# EAGLE design master-v2 (EAGLE 7.1.0)
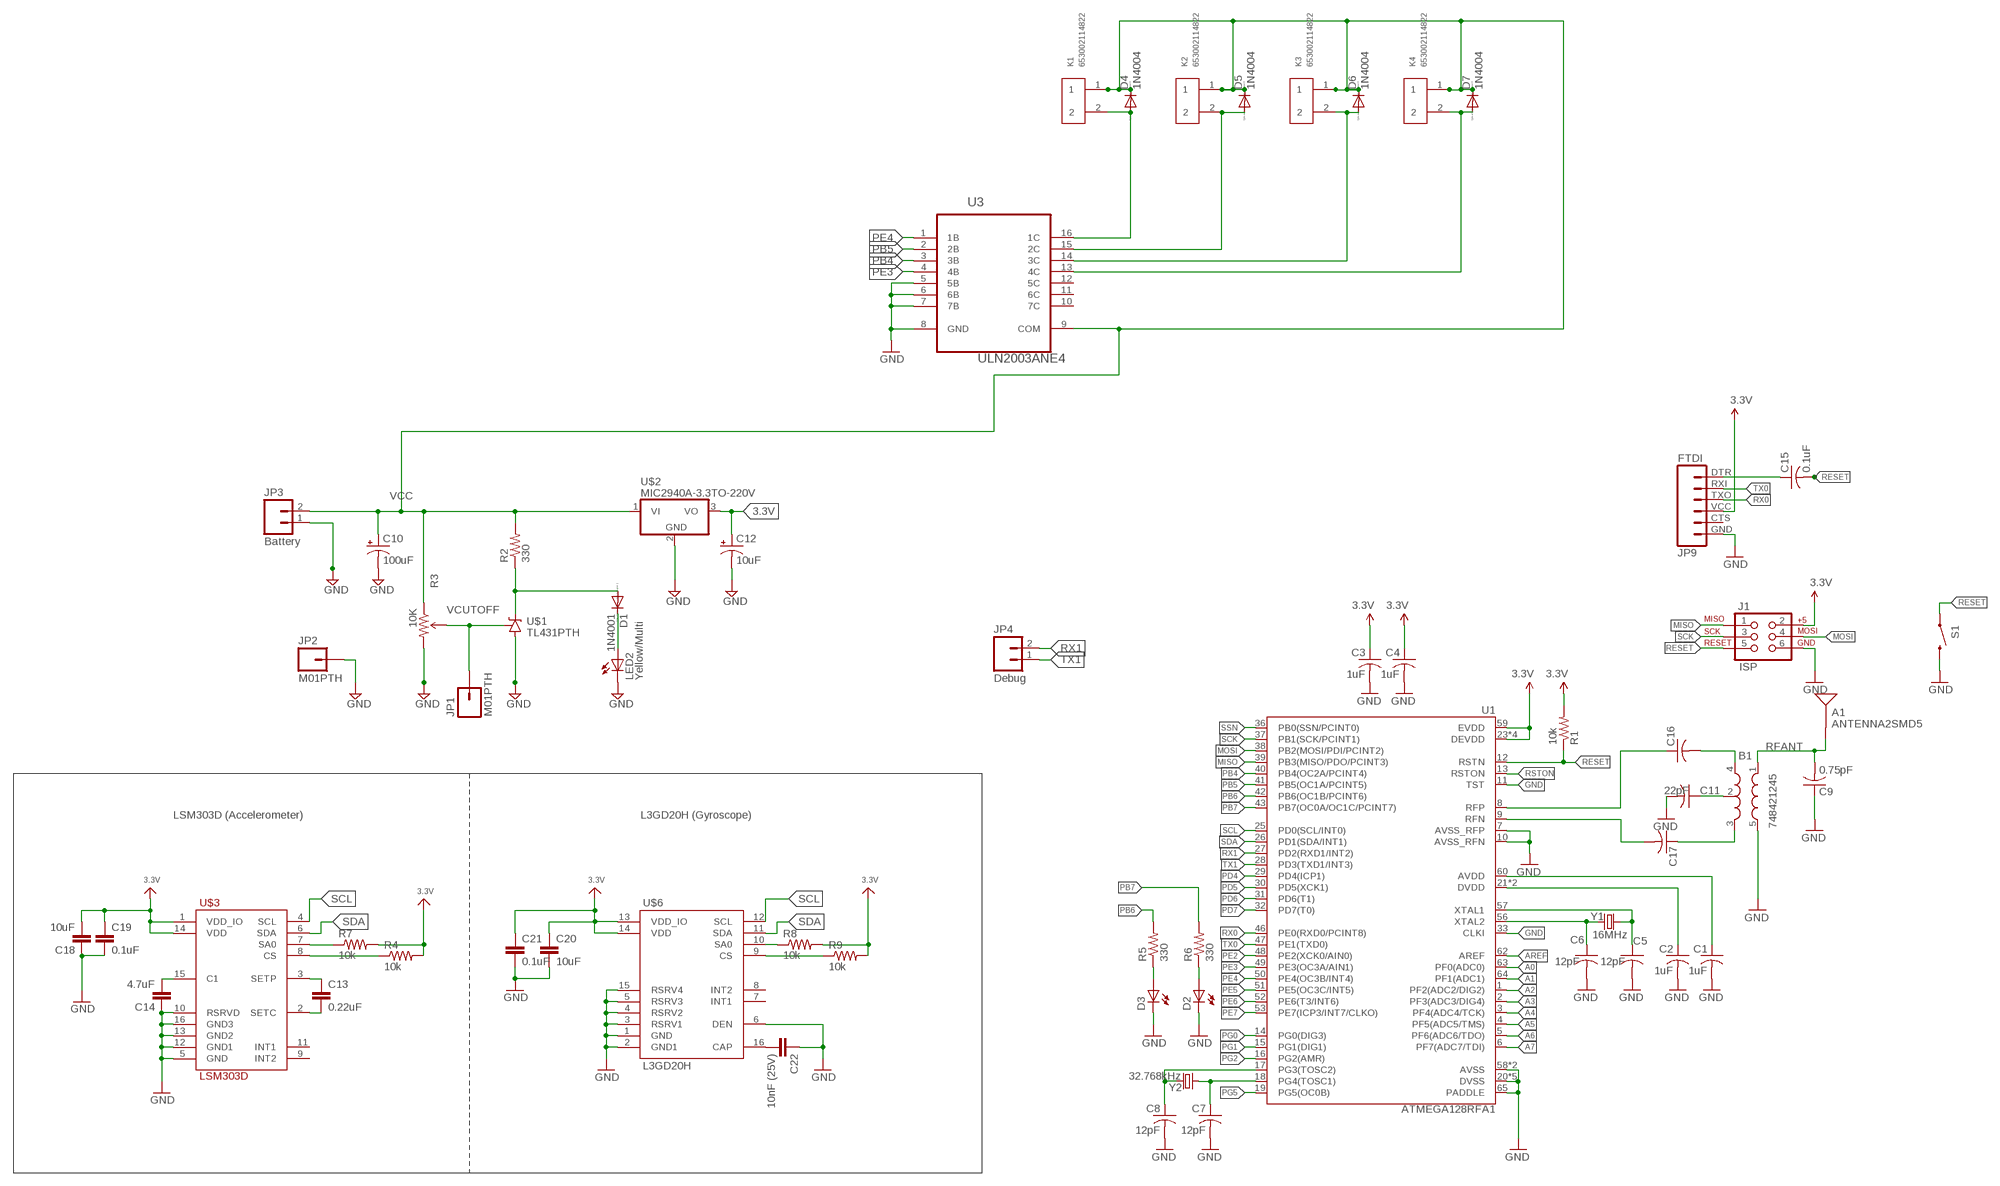
[diagram p0: schematic, sheet 1]

## Parts
A1  ANTENNA2SMD5  [ANTENNA-CHIP5]
B1  748421245  BALUN0805  [BALUN]
C1  1uF  C-USC0805  [C0805]
C2  1uF  C-USC0805  [C0805]
C3  1uF  C-USC0805  [C0805]
C4  1uF  C-USC0805  [C0805]
C5  12pF  C-USC0805  [C0805]
C6  12pF  C-USC0805  [C0805]
C7  12pF  C-USC0805  [C0805]
C8  12pF  C-USC0805  [C0805]
C9  0.75pF  C-USC0805  [C0805]
C10  100uF  CPOL-USE3.5-8  [E3,5-8]
C11  22pF  C-USC0805  [C0805]
C12  10uF  CPOL-USE2.5-5  [E2,5-5]
C13  0.22uF  CAP0805  [0805]
C14  4.7uF  CAP0805  [0805]
C15  0.1uF  C-USC0805  [C0805]
C16  C-USC0805  [C0805]
C17  C-USC0805  [C0805]
C18  10uF  CAP0805  [0805]
C19  0.1uF  CAP0805  [0805]
C20  10uF  CAP0805  [0805]
C21  0.1uF  CAP0805  [0805]
C22  10nF (25V)  CAP0805  [0805]
D1  1N4001  1N4004  [DO41-10]
D2  LED5MM  [LED5MM]
D3  LED5MM  [LED5MM]
D4  1N4004  [DO41-10]
D5  1N4004  [DO41-10]
D6  1N4004  [DO41-10]
D7  1N4004  [DO41-10]
J1  ISP  AVR_SPI_PRG_6NS  [2X3-NS]
JP1  M01PTH  [1X01]
JP2  M01PTH  [1X01]
JP3  Battery  M02PTH  [1X02]
JP4  Debug  M02PTH  [1X02]
JP9  FTDI  FTDI_BASICPTH  [FTDI_BASIC]
K1  653002114822  [653002114822]
K2  653002114822  [653002114822]
K3  653002114822  [653002114822]
K4  653002114822  [653002114822]
LED2  Yellow/Multi  LED5MM  [LED5MM]
R1  10k  R-US_R0805  [R0805]
R2  330  RESISTORAXIAL-0.3  [AXIAL-0.3]
R3  10K  TRIMPOT-PTH-KNOB  [3386U]
R4  10k  RESISTOR0805-RES  [0805]
R5  330  R-US_R0805  [R0805]
R6  330  R-US_R0805  [R0805]
R7  10k  RESISTOR0805-RES  [0805]
R8  10k  RESISTOR0805-RES  [0805]
R9  10k  RESISTOR0805-RES  [0805]
S1  SWITCH-MOMENTARY-2SMD  [TACTILE_SWITCH_SMD]
U1  ATMEGA128RFA1  [QFN-64]
U3  ULN2003ANE4  [DIP254P762X508-16]
U$1  TL431PTH  [TO-92]
U$2  MIC2940A-3.3TO-220V  [TO-220V]
U$3  LSM303D  [LGA16_3X3MM]
U$6  L3GD20H  [LGA16_3X3MM]
Y1  16MHz  CRYSTAL5X3  [CRYSTAL-SMD-5X3]
Y2  32.768kHz  CRYSTAL32-SMD  [CRYSTAL-32KHZ-SMD]

## Nets
3.3V: C3.1 C4.1 C12.+ C18.2 C19.1 C20.1 C21.1 J1.2 JP9.VCC R1.2 R4.2 R7.2 R8.2 R9.2 U1.23(DEVDD) U1.34(DEVDD) U1.44(DEVDD) U1.54(DEVDD) U1.59(EVDD) U$2.3(VO) U$3.1(VDD_IO) U$3.14(VDD) U$6.13(VDD_IO) U$6.14(VDD)
A0: U1.63(PF0(ADC0))
A1: U1.64(PF1(ADC1))
A2: U1.1(PF2(ADC2/DIG2))
A3: U1.2(PF3(ADC3/DIG4))
A4: U1.3(PF4(ADC4/TCK))
A5: U1.4(PF5(ADC5/TMS))
A6: U1.5(PF6(ADC6/TDO))
A7: U1.6(PF7(ADC7/TDI))
AREF: U1.62(AREF)
AVDD: C1.1 U1.60(AVDD)
DTR: C15.1 JP9.DTR
DVDD: C2.1 U1.21(DVDD) U1.22(DVDD)
GND: B1.5(GND) C1.2 C2.2 C3.2 C4.2 C5.2 C6.2 C7.2 C8.2 C9.1 C10.- C11.2 C12.- C14.1 C18.1 C19.2 C20.2 C21.2 C22.1 D2.K(C) D3.K(C) J1.6 JP2.1 JP3.1 JP9.GND LED2.K(C) R3.3(CW) S1.3 U1.7(AVSS_RFP) U1.10(AVSS_RFN) U1.11(TST) U1.20(DVSS) U1.24(DVSS) U1.33(CLKI) U1.35(DVSS) U1.45(DVSS) U1.55(DVSS) U1.58(AVSS) U1.61(AVSS) U1.65(PADDLE) U3.5(5B) U3.6(6B) U3.7(7B) U3.8(GND) U$1.2(A) U$2.2(GND) U$3.5(GND) U$3.10(RSRVD) U$3.12(GND1) U$3.13(GND2) U$3.16(GND3) U$6.1(GND) U$6.2(GND1) U$6.3(RSRV1) U$6.4(RSRV2) U$6.5(RSRV3) U$6.6(DEN) U$6.15(RSRV4)
MISO: J1.1 U1.39(PB3(MISO/PDO/PCINT3))
MOSI: J1.4 U1.38(PB2(MOSI/PDI/PCINT2))
N$1: D1.C LED2.A
N$2: D1.A R2.P$1 U$1.3(C)
N$3: C5.1 U1.57(XTAL1) Y1.3
N$4: C6.1 U1.56(XTAL2) Y1.1
N$5: C7.1 U1.18(PG4(TOSC1)) Y2.X1
N$6: C8.1 U1.17(PG3(TOSC2)) Y2.X2
N$7: B1.2(GND) C11.1
N$8: D3.A R5.1
N$9: C13.1 U$3.3(SETP)
N$10: B1.4(OUT1) C16.2
N$11: B1.3(OUT2) C17.1
N$12: C13.2 U$3.2(SETC)
N$13: D2.A R6.1
N$14: R4.1 U$3.8(CS)
N$15: R7.1 U$3.7(SA0)
N$16: C14.2 U$3.15(C1)
N$17: R8.1 U$6.10(SA0)
N$18: R9.1 U$6.9(CS)
N$19: C22.2 U$6.16(CAP)
N$29: D4.A K1.2 U3.16(1C)
N$30: D5.A K2.2 U3.15(2C)
N$31: D6.A K3.2 U3.14(3C)
N$32: D7.A K4.2 U3.13(4C)
PB4: U1.40(PB4(OC2A/PCINT4)) U3.3(3B)
PB5: U1.41(PB5(OC1A/PCINT5)) U3.2(2B)
PB6: R5.2 U1.42(PB6(OC1B/PCINT6))
PB7: R6.2 U1.43(PB7(OC0A/OC1C/PCINT7))
PD4: U1.29(PD4(ICP1))
PD5: U1.30(PD5(XCK1))
PD6: U1.31(PD6(T1))
PD7: U1.32(PD7(T0))
PE2: U1.48(PE2(XCK0/AIN0))
PE3: U1.49(PE3(OC3A/AIN1)) U3.4(4B)
PE4: U1.50(PE4(OC3B/INT4)) U3.1(1B)
PE5: U1.51(PE5(OC3C/INT5))
PE6: U1.52(PE6(T3/INT6))
PE7: U1.53(PE7(ICP3/INT7/CLKO))
PG0: U1.14(PG0(DIG3))
PG1: U1.15(PG1(DIG1))
PG2: U1.16(PG2(AMR))
PG5: U1.19(PG5(OC0B))
RESET: C15.2 J1.5 R1.1 S1.1 U1.12(RSTN)
RFANT [RFSIG]: A1.FEED(SIGNAL) B1.1(IN) C9.2
RFN: C17.2 U1.9(RFN)
RFP: C16.1 U1.8(RFP)
RSTON: U1.13(RSTON)
RX0: JP9.TXO U1.46(PE0(RXD0/PCINT8))
RX1: JP4.2 U1.27(PD2(RXD1/INT2))
SCK: J1.3 U1.37(PB1(SCK/PCINT1))
SCL: U1.25(PD0(SCL/INT0)) U$3.4(SCL) U$6.12(SCL)
SDA: U1.26(PD1(SDA/INT1)) U$3.6(SDA) U$6.11(SDA)
SSN: U1.36(PB0(SSN/PCINT0))
TX0: JP9.RXI U1.47(PE1(TXD0))
TX1: JP4.1 U1.28(PD3(TXD1/INT3))
VCC: C10.+ D4.C D5.C D6.C D7.C JP3.2 K1.1 K2.1 K3.1 K4.1 R2.P$2 R3.1(CCW) U3.9(COM) U$2.1(VI)
VCUTOFF: JP1.1 R3.2(WIPER) U$1.1(R)
Unconnected: JP9.CTS U3.10(7C) U3.11(6C) U3.12(5C) U$3.9(INT2) U$3.11(INT1) U$6.7(INT1) U$6.8(INT2)

## Notes on the sheet
- LSM303D (Accelerometer) | L3GD20H (Gyroscope)

## Library data of the parts
A1 = SparkFun-RF:ANTENNA2: Chip antenna Single endded antenna. Common with smaller chip antennas. CHIP4 package is the GPS Chip Antenna SKU: GPS-08418. CHIP5 package is 2.4GHz chip antenna SKU: WRL-00144.
B1 = SparkFun-RF:BALUN: 0805 footprint balun- Ember 351/357
C1-C9 C11 C15-C17 = resistor:C-US: CAPACITOR, American symbol
C10 C12 = rcl:CPOL-US: POLARIZED CAPACITOR, American symbol
C13 C14 C18-C22 = SparkFun-Capacitors:CAP: Capacitor Standard 0603 ceramic capacitor, and 0.1" leaded capacitor.
D1 = diode:1N4004: DIODE general purpose rectifier, 1 A
D2 D3 = Components:LED: LED OSRAM: - CHIPLED LG R971, LG N971, LY N971, LG Q971, LY Q971, LO R971, LY R971 LH N974, LH R974 LS Q976, LO Q976, LY Q976 LO Q996 - Hyper CHIPLED LW Q18S LB Q993, LB Q99A, LB R99A - SideLED LS A670, LO A670, LY A670, LG A670, LP A670 LB A673, LV A673, LT A673, LW A673 LH A674 LY A675 LS A676, LA A676, LO A676, LY A676, LW A676 LS A679, LY A679, LG A679 - Hyper Micro SIDELED® LS Y876, LA Y876, LO Y876, LY Y876 LT Y87S - SmartLED LW L88C, LW L88S LB L89C, LB L89S, LG L890 LS L89K, LO L89K, LY L89K LS L896, LA L896, LO L896, LY L896 - TOPLED LS T670, LO T670, LY T670, LG T670, LP T670 LSG T670, LSP T670, LSY T670, LOP T670, LYG T670 LG T671, LOG T671, LSG T671 LB T673, LV T673, LT T673, LW T673 LH T674 LS T676, LA T676, LO T676, LY T676, LB T676, LH T676, LSB T676, LW T676 LB T67C, LV T67C, LT T67C, LS T67K, LO T67K, LY T67K, LW E67C LS E67B, LA E67B, LO E67B, LY E67B, LB E67C, LV E67C, LT E67C LW T67C LS T679, LY T679, LG T679 LS T770, LO T770, LY T770, LG T770, LP T770 LB T773, LV T773, LT T773, LW T773 LH T774 LS E675, LA E675, LY E675, LS T675 LS T776, LA T776, LO T776, LY T776, LB T776 LHGB T686 LT T68C, LB T68C - Hyper Mini TOPLED® LB M676 - Mini TOPLED Santana® LG M470 LS M47K, LO M47K, LY M47K Source: http://www.osram.convergy.de/
D4-D7 = diode:1N4004: DIODE general purpose rectifier, 1 A; MF: NTE ELECTRONICS; MPN: 1N4004; OC_FARNELL: 2295710
J1 = SparkFun-Connectors:AVR_SPI_PRG_6: AVR ISP 6 Pin This is the reduced ISP connector for AVR programming. Common on Arduino. This footprint will take up less PCB space and can be used with a 10-pin to 6-pin adapter such as SKU: BOB-08508
JP1 JP2 = SparkFun:M01: Header 1 Standard 1-pin 0.1" header. Use with straight break away headers (SKU : PRT-00116), right angle break away headers (PRT-00553), swiss pins (PRT-00743), machine pins (PRT-00117), and female headers (PRT-00115).
JP3 JP4 = SparkFun:M02: Header 2 Standard 2-pin 0.1" header. Use with straight break away headers (SKU : PRT-00116), right angle break away headers (PRT-00553), swiss pins (PRT-00743), machine pins (PRT-00117), and female headers (PRT-00115). Molex polarized connector foot print use with SKU : PRT-08233 with associated crimp pins and housings.
JP9 = SparkFun-Connectors:FTDI_BASIC: FTDI Basic header with labels
K1-K4 = Wuerth_Elektronik_eiCan_Wire_to_Board_Connectors:653002114822: WR-WTB 1.25mm Male Vertical Shrouded Header, 2 Pins=>Code : Con_WTB_1.25_PCB_THT_653002114822 <http://katalog.we-online.de/media/thumbs2/eican/thb_Con_WTB_1.25_PCB_THT_6530xx114822_pf2.jpg> Details see: http://katalog.we-online.de/en/em/653_0xx_114_822 Created 2014-06-06, Karrer Zheng 2014 (C) Würth Elektronik; OC_FARNELL: unknown
LED2 = SparkFun:LED: LEDs Standard schematic elements and footprints for 5mm, 3mm, 1206, and 0603 sized LEDs. 5mm - Spark Fun Electronics SKU : COM-00529 (and others)
R1 R5 R6 = resistor:R-US_: RESISTOR, American symbol
R2 = SparkFun:RESISTOR: Resistor Basic schematic elements and footprints for 0603, 1206, and PTH resistors.
R3 = Power:TRIMPOT; CREATOR: Brandon; REVIEWER1: Chris
R4 R7-R9 = SparkFun-Passives:RESISTOR: Resistor Basic schematic elements and footprints for 0603, 1206, and PTH resistors.
S1 = SparkFun-Electromechanical:SWITCH-MOMENTARY-2: Various NO switches- pushbuttons, reed, etc
U1 = SparkFun-DigitalIC:ATMEGA128RFA1: ATmega128RFA1 8-bit AVR Microcontroller with Low Power 2.4GHz Transceiver for ZigBee and IEEE 802.15.4
U3 = Texas Instruments_By_element14_Batch_1:ULN2003ANE4: HIGH-VOLTAGE, HIGH-CURRENT DARLINGTON TRANSISTOR ARRAYS; MPN: ULN2003ANE4; OC_FARNELL: 1210973; OC_NEWARK: 98K2130; PACKAGE: PDIP-16; SUPPLIER: Texas Instruments
U$1 = SparkFun:TL431
U$2 = SparkFun:MIC2940A-3.3: MIC2940A-3.3 Voltage Regulator 3.3V mic2940.pdf
U$3 = IMU_parts:LSM303D
U$6 = IMU_parts:L3GD20H
Y1 Y2 = SparkFun-FreqCtrl:CRYSTAL: Various standard crystals. Proven footprints. Spark Fun Electronics SKU : COM-00534

## Net classes
0 default: clearance 0.205 mm
1 RFSIG: width 0.457 mm, clearance 0.205 mm to class 0, clearance 0.205 mm

## Board
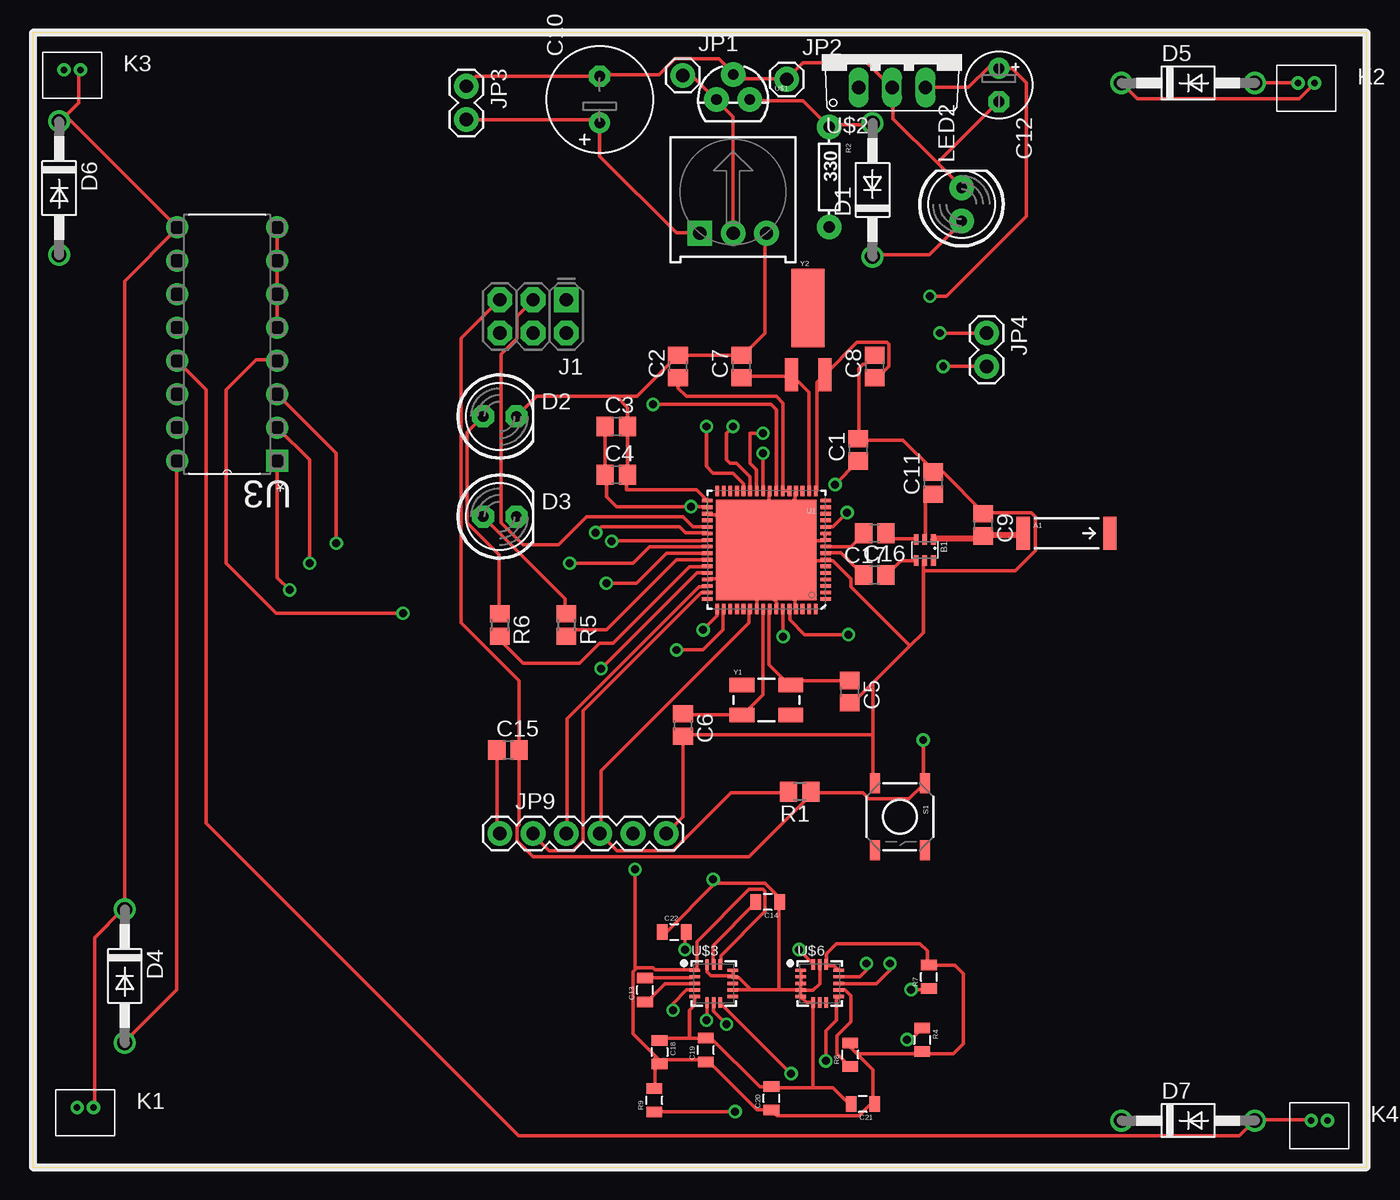
[diagram p1: board, top side]
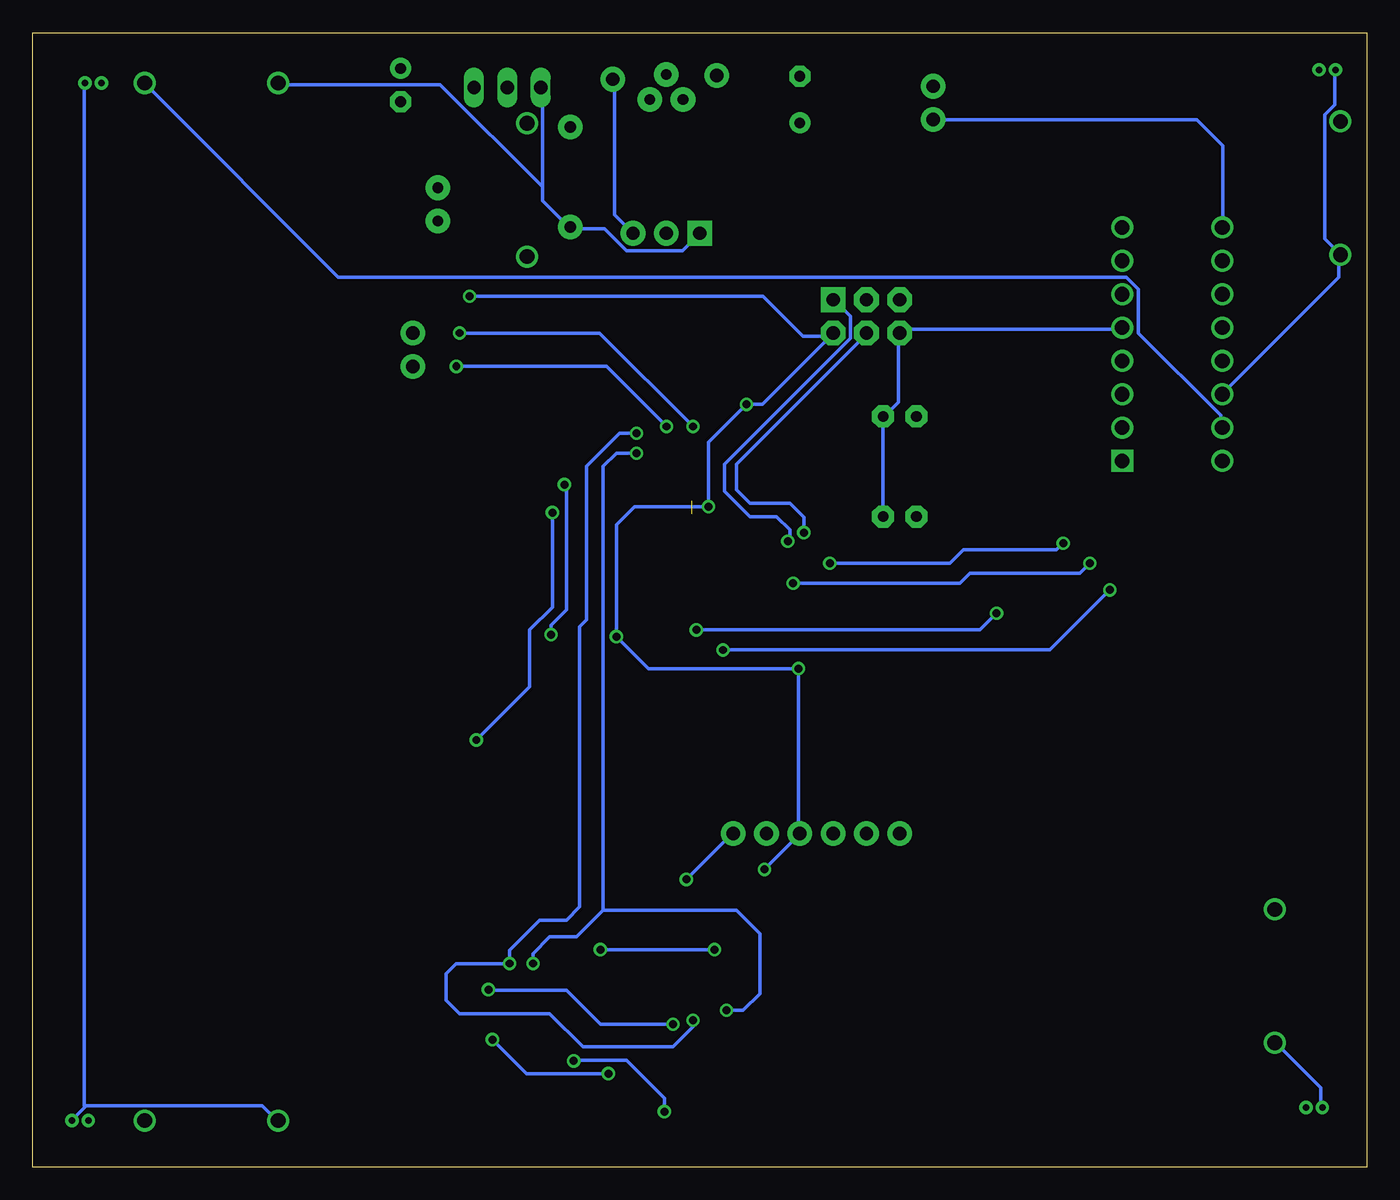
[diagram p2: board, bottom side, seen from below]

Size 101.6 x 86.36 mm. Coordinates in mm from the lower left corner, seen from the top.
Outline: 0,0 101.6,0 101.6,86.36 0,86.36 0,0
Copper layers (1*16): Top 0.035mm / dielectric 1.5mm / Bottom 0.035mm
Design rules "default *": minimum track width 10mil, minimum drill 24mil, track to track 6mil, track to pad 6mil, pad to pad 6mil, via to via 8mil, smd to smd 6mil, copper to edge 40mil, drill to drill 6mil, minimum pad ring 10mil, minimum via ring 8mil, stop-mask expansion 4mil, vias tented up to drill 0mil, thermal gap 10mil

### Footprints (pad centres in the part's own frame; a part is rotated, then mirrored left to right if it is on the bottom)
ANTENNA-CHIP5 = smd 1.016 x 2.54: FEED -3.302,0; NC 3.302,0
BALUN = smd 0.35 x 0.8: 1 -0.65,-0.8; 2 0,-0.8; 3 0.65,-0.8; 4 0.65,0.8; 5 0,0.8; 6 -0.65,0.8
C0805 = smd 1.3 x 1.5: 1 -0.85,0; 2 0.85,0
E3,5-8 = drill 0.813 pad 1.6: + -1.778,0 | drill 0.813 pad 1.6 octagon: - 1.778,0
E2,5-5 = drill 0.813 pad 1.6: + -1.27,0 | drill 0.813 pad 1.6 octagon: - 1.27,0
0805 = smd 0.8 x 1.2: 1 -0.9,0; 2 0.9,0
DO41-10 = drill 1.118: A 5.08,0; C -5.08,0
LED5MM = drill 0.813 pad 1.676 octagon: A -1.27,0; K 1.27,0
2X3-NS = drill 1.016 pad 1.88 square: 1 -2.54,-1.27 | drill 1.016 pad 1.88 octagon: 2 -2.54,1.27; 3 0,-1.27; 4 0,1.27; 5 2.54,-1.27; 6 2.54,1.27
1X01 = drill 1.016 pad 1.88: 1 0,0
1X02 = drill 1.016 pad 1.88: 1 0,0; 2 2.54,0
FTDI_BASIC = drill 1.016 pad 1.88: CTS 10.16,0; DTR 0,0; GND 12.7,0; RXI 2.54,0; TXO 5.08,0; VCC 7.62,0
653002114822 = drill 0.5: 1 0.625,0; 2 -0.625,0
LED5MM' = drill 0.813 pad 1.88: A -1.27,0; K 1.27,0
R0805 = smd 1.3 x 1.5: 1 -0.85,0; 2 0.85,0
AXIAL-0.3 = drill 0.9 pad 1.88: P$1 -3.81,0; P$2 3.81,0
3386U = drill 1.016 pad 1.88 square: 1 -2.54,-2.555 | drill 1.016 pad 1.88: 2 0,-2.555; 3 2.54,-2.555
TACTILE_SWITCH_SMD = smd 1.524 x 0.762: 1 -2.54,1.905; 2 2.54,1.905; 3 -2.54,-1.905; 4 2.54,-1.905
QFN-64 = smd 0.8 x 0.28: 1 -4.5,3.75; 2 -4.5,3.25; 3 -4.5,2.75; 4 -4.5,2.25; 5 -4.5,1.75; 6 -4.5,1.25; 7 -4.5,0.75; 8 -4.5,0.25; 9 -4.5,-0.25; 10 -4.5,-0.75; 11 -4.5,-1.25; 12 -4.5,-1.75; 13 -4.5,-2.25; 14 -4.5,-2.75; 15 -4.5,-3.25; 16 -4.5,-3.75; 33 4.5,-3.75; 34 4.5,-3.25; 35 4.5,-2.75; 36 4.5,-2.25; 37 4.5,-1.75; 38 4.5,-1.25; 39 4.5,-0.75; 40 4.5,-0.25; 41 4.5,0.25; 42 4.5,0.75; 43 4.5,1.25; 44 4.5,1.75; 45 4.5,2.25; 46 4.5,2.75; 47 4.5,3.25; 48 4.5,3.75 | smd 0.28 x 0.8: 17 -3.75,-4.5; 18 -3.25,-4.5; 19 -2.75,-4.5; 20 -2.25,-4.5; 21 -1.75,-4.5; 22 -1.25,-4.5; 23 -0.75,-4.5; 24 -0.25,-4.5; 25 0.25,-4.5; 26 0.75,-4.5; 27 1.25,-4.5; 28 1.75,-4.5; 29 2.25,-4.5; 30 2.75,-4.5; 31 3.25,-4.5; 32 3.75,-4.5; 49 3.75,4.5; 50 3.25,4.5; 51 2.75,4.5; 52 2.25,4.5; 53 1.75,4.5; 54 1.25,4.5; 55 0.75,4.5; 56 0.25,4.5; 57 -0.25,4.5; 58 -0.75,4.5; 59 -1.25,4.5; 60 -1.75,4.5; 61 -2.25,4.5; 62 -2.75,4.5; 63 -3.25,4.5; 64 -3.75,4.5 | smd 7.65 x 7.65: 65 0,0
DIP254P762X508-16 = drill 1.118 square: 1 -7.62,17.78 | drill 1.118: 2 -7.62,15.24; 3 -7.62,12.7; 4 -7.62,10.16; 5 -7.62,7.62; 6 -7.62,5.08; 7 -7.62,2.54; 8 -7.62,0; 9 0,0; 10 0,2.54; 11 0,5.08; 12 0,7.62; 13 0,10.16; 14 0,12.7; 15 0,15.24; 16 0,17.78
TO-92 = drill 0.813 pad 1.88: 1 -1.27,0; 2 0,1.905; 3 1.27,0
TO-220V = drill 1.016 long: 1 -1.27,0; 2 1.27,0; 3 3.81,0
LGA16_3X3MM = smd 0.8 x 0.25: 1 -1.45,1; 2 -1.45,0.5; 3 -1.45,0; 4 -1.45,-0.5; 5 -1.45,-1; 9 1.45,-1; 10 1.45,-0.5; 11 1.45,0; 12 1.45,0.5; 13 1.45,1 | smd 0.25 x 0.8: 6 -0.5,-1.45; 7 0,-1.45; 8 0.5,-1.45; 14 0.5,1.45; 15 0,1.45; 16 -0.5,1.45
CRYSTAL-SMD-5X3 = smd 1.9 x 1.1: 1 -1.85,-1.15; 2 1.85,-1.15; 3 1.85,1.15; 4 -1.85,1.15
CRYSTAL-32KHZ-SMD = smd 2.5 x 6: SHEILD 0,5.08 | smd 1 x 2.5: X1 -1.27,0; X2 1.27,0

### Placement (x,y rotation side)
A1  78.74,48.26 0 top
B1  67.94,46.99 180 top
C1  62.87,54.61 90 top
C2  49.15,60.96 90 top
C3  44.45,56.39 0 top
C4  44.45,52.7 0 top
C5  62.23,36.2 270 top
C6  49.53,33.66 270 top
C7  53.98,60.96 90 top
C8  64.14,60.96 90 top
C9  72.39,48.89 270 top
C10  43.18,81.28 90 top
C11  68.58,52.07 90 top
C12  73.58,82.38 270 top
C13  46.64,13.48 90 top
C14  55.98,20.18 180 top
C15  36.2,31.75 0 top
C16  64.14,45.09 0 top
C17  64.14,48.26 180 top
C18  47.74,8.75 270 top
C19  51.26,8.91 90 top
C20  56.26,5.24 90 top
C21  63.22,4.8 180 top
C22  48.86,17.9 0 top
D1  63.96,74.4 90 top
D2  35.56,57.15 0 top
D3  35.56,49.53 0 top
D4  7,14.54 270 top
D5  88,82.54 0 top
D6  2,74.54 270 top
D7  88,3.54 0 top
J1  38.1,64.77 180 top
JP1  49.5,83.12 0 top
JP2  57.42,82.82 0 top
JP3  33.02,82.3 270 top
JP4  72.64,63.5 270 top
JP9  35.56,25.4 0 top
K1  4,4.54 0 top
K2  97,82.54 0 top
K3  3,83.54 0 top
K4  98,3.54 0 top
LED2  Yellow/Multi  [LED5MM']  70.74,73.3 90 top
R1  58.42,28.57 180 top
R2  60.66,75.38 270 top
R3  53.34,73.66 0 top
R4  67.74,9.68 270 top
R5  40.64,41.27 270 top
R6  35.56,41.27 270 top
R7  68.26,14.48 90 top
R8  62.26,8.56 90 top
R9  47.34,5.08 90 top
S1  66.04,26.67 270 top
U1  55.88,46.99 180 top
U3  11,71.54 180 top
U$1  53.34,81.28 0 top
U$2  64.18,82.2 0 top
U$3  51.86,13.98 0 top
U$6  59.94,13.98 0 top
Y1  55.88,35.56 0 top
Y2  59.05,60.32 0 top

### Tracks (layer width: path | path; a pad name or v marks a point on that pad's centre or on a via)
3.3V  (via drill 0.6, 0.61)
  Top 0.254: v43.28,37.95 50.6,45.26 51.36,45.26 U1.44 | U1.54 54.56,42.37 54.56,41.45 43.28,30.18 43.28,25.45 JP9.VCC 44.5,24.08 48.77,24.08 53.19,28.5 57.45,28.5 R1.2 | U1.34 51.36,50.29 v50.14,50.29 44.45,50.29 43.69,51.05 43.69,52.62 C4.1 C3.1 | 56.69,51.51 U1.23 56.64,51.5 56.64,57.66 56.24,58.06 v47.24,58.06 | v57.15,40.39 57.15,42.37 U1.59 | 61.27,15.04 U$6.13 61.03,15.34 60.5,15.34 U$6.14 60.45,15.44 60.45,16.26 61.21,17.02 67.56,17.02 68.12,16.46 68.12,15.34 R7.2 70.22,15.38 70.87,14.73 70.87,9.4 70.1,8.64 67.67,8.64 | 62.87,8.56 64.01,7.42 64.01,4.83 C21.1 64.01,4.67 63.7,4.67 62.94,3.91 56.69,3.91 56.39,4.22 C20.1 56.24,4.37 55.17,4.37 51.36,8.18 C19.1 51.21,8.18 47.85,8.18 C18.2 | 62.87,8.56 62.71,8.71 | 62.71,8.71 62.33,9.09 62.33,9.4 R8.2 | 62.94,8.64 67.67,8.64 | 67.67,8.64 R4.2 | 62.94,8.64 62.87,8.56 | 62.71,8.71 62.79,8.79 62.94,8.64 | 45.95,15.11 45.72,14.88 45.72,10.16 47.7,8.18 C18.2 | 45.95,15.11 46.02,15.19 47.24,15.19 47.4,15.04 50.29,15.04 U$3.1 50.44,15.04 50.6,15.19 50.6,17.17 54.56,21.13 55.63,21.13 55.78,20.98 55.78,19.46 52.43,16.1 52.43,15.49 U$3.14 | R9.2 47.4,6.04 47.4,8.33 C18.2 | v45.87,22.66 45.87,15.19 45.95,15.11 | U$2.3 71.28,82.2 72.9,83.82 73.41,83.82 C12.+ 74.59,83.65 75.69,82.55 75.69,72.39 69.6,66.29 v68.33,66.29
  Bottom 0.254: v45.87,22.66 43.13,25.4 JP9.VCC 43.28,25.45 v43.28,37.95 54.71,37.95 v57.15,40.39 57.15,48.92 55.78,50.29 v50.14,50.29 50.14,55.17 v47.24,58.06 46.02,58.06 40.69,63.4 J1.2 40.89,63.25 42.93,63.25 45.97,66.29 v68.33,66.29
AVDD  (via drill 0.61)
  Top 0.254: v61.11,51.97 62.79,53.64 C1.1 | U1.60 57.61,42.37 57.66,42.32 57.66,41.66 58.78,40.54 v62.13,40.54
  Bottom 0.254: v61.11,51.97 60.96,51.82 60.96,42.42 62.13,41.25 v62.13,40.54
DTR
  Top 0.254: JP9.DTR 35.36,25.6 35.36,31.7 C15.1
DVDD
  Top 0.254: 57.15,51.51 57.61,51.51 U1.21 | 57.15,51.51 U1.22 | 57.15,51.51 57.15,58.17 56.64,58.67 49.78,58.67 49.15,59.31 C2.1
GND  (via drill 0.61)  (1 unrouted)
  Top 0.254: U1.11 60.35,48.16 60.35,47.85 U1.10 60.35,47.7 56.08,47.7 | 55.17,44.81 55.17,46.33 55.78,46.94 U1.65 | 55.17,44.81 55.17,44.5 | 55.17,44.5 55.17,42.52 U1.55 | 55.17,44.5 56.69,42.98 56.69,42.52 U1.58 | 55.17,44.5 U1.65 | U1.61 58.06,42.52 58.06,43.13 57.91,43.28 56.54,43.28 U1.65 | 55.17,44.81 51.51,44.81 U1.45 | 55.17,44.81 U1.65 | U1.35 51.51,49.68 51.97,49.68 55.17,46.48 U1.65 | 56.08,47.7 56.08,46.48 U1.65 | 56.08,47.7 56.08,48.92 | 56.08,48.92 56.08,51.36 U1.24 | 56.08,48.92 58.06,50.9 58.06,51.36 U1.20 | 56.08,48.92 U1.65 | U1.65 56.08,46.18 60.35,46.18 U1.7 60.5,46.18 60.96,46.18 62.33,44.81 62.33,44.2 66.83,39.7 | 56.08,47.7 U1.65 | 72.39,49.84 69.34,52.88 68.58,52.88 C11.2 68.58,53.03 66.29,55.32 62.94,55.32 C1.2 62.94,55.47 62.94,60.81 63.25,61.11 63.4,61.11 64.01,61.72 C8.2 | JP9.GND 49.53,26.67 C6.2 49.53,32.92 64.01,32.92 | 67.82,45.41 67.82,40.69 66.83,39.7 | 67.82,45.41 67.82,46.18 B1.5 | 63.93,36.8 62.33,35.2 C5.2 | 63.93,36.8 66.83,39.7 | 64.01,32.92 64.01,36.73 63.93,36.8 | 64.01,32.92 64.01,29.26 S1.3 | 72.39,49.84 76.05,49.84 76.35,49.53 76.35,46.94 74.83,45.41 67.82,45.41 | 72.39,49.84 C9.1 | 51.89,21.51 51.97,21.59 55.78,21.59 56.84,20.52 56.84,20.22 C14.1 56.84,20.07 56.84,13.51 | 51.89,21.51 48.31,17.93 48.01,17.93 C22.1 | U$3.12 53.34,14.58 53.34,14.88 U$3.13 | U$3.16 51.36,15.34 51.36,14.88 51.66,14.58 53.19,14.58 U$3.12 | U$6.1 58.52,14.88 58.52,14.58 U$6.2 58.52,14.43 58.52,14.01 U$6.3 U$6.4 | 56.84,13.51 58.37,13.51 58.4,13.48 U$6.4 | 56.84,13.51 54.71,13.51 | 54.71,13.51 53.34,13.51 U$3.10 | 54.71,13.51 53.8,14.43 53.34,14.43 U$3.12 | 59.44,6.04 60.96,6.04 62.18,4.83 C21.2
  Top 0.254: 59.44,6.04 56.39,6.04 C20.2 56.22,6.1 55.37,6.1 51.66,9.81 C19.2 50.04,9.81 | 59.44,6.04 59.44,12.45 U$6.6 58.94,12.53 U$6.5 U$6.4 | 68.89,76.45 70.71,74.62 LED2.K | 68.89,76.45 65.53,79.81 65.53,82.09 U$2.2 65.38,82.25 63.55,84.07 58.67,84.07 JP2.1 57.3,82.86 53.65,82.86 53.34,83.16 U$1.2 53.34,83.31 52.27,84.38 48.92,84.38 47.7,83.16 43.28,83.16 C10.- | 68.89,76.45 73.46,81.03 C12.- | 43.13,83.16 C10.- | U3.5 18.59,63.96 18.59,66.4 U3.6 18.59,66.55 18.59,68.99 U3.7 18.59,69.14 18.59,71.43 U3.8 | R3.3 55.78,70.97 55.78,63.5 54.1,61.82 C7.2 C2.2 46.01,58.67 44.45,58.67 | v51.82,21.89 51.82,21.59 51.89,21.51 | 44.45,58.67 45.3,57.82 C3.2 C4.2 45.21,52.62 45.21,51.56 50.56,51.56 U1.33 | 44.45,58.67 38.35,58.67 D2.K | 50.04,9.81 47.9,9.81 C18.1 | U$3.5 50.41,12.31 50.04,11.94 50.04,9.81 | U$6.15 59.94,13.97 59.44,13.46 58.51,13.46 U$6.4 | JP3.1 33.78,83.06 C10.-
  Bottom 0.254: JP2.1 57.3,82.7 57.3,72.49 55.93,71.12 R3.3 | U3.5 18.75,63.8 35.2,63.8 35.51,63.5 J1.6 35.66,63.4 35.66,58.22 36.73,57.15 D2.K D3.K | v51.82,21.89 48.31,25.4 JP9.GND
MISO  (via drill 0.61)
  Top 0.254: U1.39 51.36,47.7 44.15,47.7 v44.09,47.65
  Bottom 0.254: J1.1 40.54,65.99 39.32,64.77 39.32,63.09 48.92,53.49 48.92,51.46 46.99,49.53 44.96,49.53 43.94,48.51 43.94,47.8 v44.09,47.65
MOSI  (via drill 0.61)
  Top 0.254: U1.38 51.36,48.31 49.73,48.31 49.28,48.77 43.33,48.77 v42.88,48.31
  Bottom 0.254: J1.4 38.1,63.4 48.01,53.49 48.01,51.56 46.99,50.55 43.94,50.55 42.88,49.48 v42.88,48.31
N$1
  Top 0.254: D1.C 64.01,69.44 68.28,69.44 70.71,71.88 LED2.A
N$2
  Top 0.254: D1.A 63.86,79.35 60.96,79.35 60.81,79.2 R2.P$1 58.67,81.18 54.71,81.18 U$1.3
N$3
  Top 0.254: U1.57 56.08,42.37 56.08,38.25 57.61,36.73 Y1.3 57.45,37.03 62.18,37.03 C5.1
N$4
  Top 0.254: U1.56 55.63,42.37 55.63,35.97 54.1,34.44 Y1.1 53.95,34.44 49.53,34.44 C6.1
N$5
  Top 0.254: U1.18 59.13,51.51 59.13,58.98 Y2.X1 57.76,60.2 54.1,60.2 C7.1
N$6
  Top 0.254: U1.17 59.74,51.51 59.74,59.74 Y2.X2 62.79,62.79 65.08,62.79 65.23,62.64 65.23,60.96 64.47,60.2 64.16,60.2 C8.1
N$7
  Top 0.254: B1.2 67.97,47.85 67.97,50.6 68.58,51.21 C11.1
N$8
  Top 0.254: D3.A 40.54,43.28 40.54,42.21 R5.1
N$9
  Top 0.254: U$3.3 50.29,13.97 48.16,13.97 46.79,12.6 C13.1
N$10
  Top 0.254: B1.4 67.21,46.18 66.14,46.18 65.08,45.11 C16.2
N$11
  Top 0.254: B1.3 67.21,47.85 65.38,47.85 65.08,48.16 C17.1
N$12
  Top 0.254: U$3.2 50.29,14.43 46.79,14.43 C13.2
N$13
  Top 0.254: D2.A 33.07,55.93 33.07,49.07 35.51,46.63 35.51,42.21 R6.1
N$14  (via drill 0.61)
  Top 0.254: v57.76,7.11 52.43,12.45 U$3.8 | v66.6,9.7 66.9,9.7 67.67,10.46 R4.1
  Bottom 0.254: v57.76,7.11 64.01,7.11 v66.6,9.7
N$15  (via drill 0.61)
  Top 0.254: v66.9,13.51 68.12,13.51 R7.1 | U$3.7 51.86,11.84 v52.83,10.87
  Bottom 0.254: v52.83,10.87 58.37,10.87 60.96,13.46 66.85,13.46 v66.9,13.51
N$16
  Top 0.254: U$3.15 51.82,15.49 51.82,16.87 55.02,20.07 C14.2
N$17
  Top 0.254: U$6.10 61.42,13.51 61.87,13.51 62.33,13.06 62.33,11.07 61.27,10.01 61.27,8.64 62.18,7.72 R8.1
N$18  (via drill 0.61)
  Top 0.254: v53.49,4.22 47.4,4.22 R9.1 | 61.42,12.9 U$6.9 61.21,12.8 61.21,11.18 60.4,10.36 v60.4,8.08
  Bottom 0.254: v53.49,4.22 53.49,5.23 56.39,8.13 60.35,8.13 v60.4,8.08
N$19  (via drill 0.61)
  Top 0.254: v58.37,16.56 59.44,15.49 U$6.16 | v49.68,16.56 49.68,17.78 C22.2
  Bottom 0.254: v49.68,16.56 v58.37,16.56
N$29
  Top 0.254: U3.16 10.97,53.75 10.97,13.51 7.01,9.55 D4.A
  Bottom 0.254: K1.2 3.5,4.67 3.5,6.04 6.86,9.4 D4.A
N$30
  Top 0.254: K2.2 96.32,82.55 93.12,82.55 D5.A
  Bottom 0.254: U3.15 11.12,56.34 11.12,57.25 17.37,63.5 17.37,66.85 18.29,67.77 78.33,67.77 92.96,82.4 D5.A
N$31
  Bottom 0.254: K3.2 2.44,83.46 2.44,80.87 3.2,80.11 3.2,70.66 2.13,69.6 D6.A 2.13,69.44 2.13,67.77 10.97,58.93 U3.14
N$32
  Top 0.254: K4.2 97.23,3.61 93.12,3.61 D7.A 92.96,3.45 91.9,2.39 36.98,2.39 13.21,26.16 13.21,59.17 U3.13
PB4  (via drill 0.61)
  Top 0.254: U1.40 46.99,47.24 45.72,45.97 v40.89,45.97 | v23.11,47.5 23.11,54.35 U3.3
  Bottom 0.254: v40.89,45.97 31.75,45.97 30.73,46.99 23.62,46.99 v23.11,47.5
PB5  (via drill 0.61)
  Top 0.254: U1.41 48.26,46.74 45.97,44.45 v43.69,44.45 | v21.08,45.97 21.08,53.84 U3.2
  Bottom 0.254: v43.69,44.45 30.99,44.45 30.23,45.21 21.84,45.21 v21.08,45.97
PB6
  Top 0.254: U1.42 49.03,46.24 43.69,40.89 41.11,40.89 R5.2
PB7
  Top 0.254: U1.43 51.36,45.72 50.04,45.72 44.2,39.88 43.18,39.88 41.66,38.35 37.34,38.35 35.56,40.13 R6.2
PE3  (via drill 0.61)
  Top 0.254: U1.49 52.13,41.97 v51.05,40.89 | v28.19,42.16 18.54,42.16 14.73,45.97 14.73,59.18 17.02,61.47 18.53,61.47 U3.4
  Bottom 0.254: v51.05,40.89 29.46,40.89 v28.19,42.16
PE4  (via drill 0.6)
  Top 0.254: U1.50 52.58,42.44 52.58,40.89 51.05,39.37 v49.02,39.37 | v19.56,43.94 18.62,44.88 U3.1
  Bottom 0.254: v49.02,39.37 24.13,39.37 v19.56,43.94
RESET  (via drill 0.6, 0.61)
  Top 0.254: 59.44,28.5 63.25,28.5 63.7,28.04 66.75,28.04 67.82,29.11 S1.1 67.82,29.34 v67.82,32.51 | 59.44,28.5 59.28,28.5 R1.1 59.44,28.5 | 59.44,28.5 54.56,23.62 38.1,23.62 36.88,24.84 36.88,25.91 37.03,26.06 37.03,31.7 C15.2 37.03,31.85 37.03,37.03 32.61,41.45 32.61,63.09 J1.5 | v62.03,49.84 60.96,48.77 60.5,48.77 U1.12
  Bottom 0.254: v62.03,49.84 62.03,42.62 63.75,40.89 63.75,36.58 v67.82,32.51
RFANT
  Top 0.457: B1.1 68.73,47.85 72.24,47.85 72.39,48.01 C9.2 72.54,48.16 75.44,48.16 A1.FEED
RFN
  Top 0.254: U1.9 60.5,47.24 62.33,47.24 63.25,48.16 C17.2
RFP
  Top 0.254: U1.8 60.5,46.79 61.57,46.79 63.25,45.11 C16.1
RX0
  Top 0.254: U1.46 51.36,44.2 50.75,44.2 40.69,34.14 40.69,25.45 JP9.TXO
RX1  (via drill 0.6)
  Top 0.254: U1.27 54.63,52.56 53.59,53.59 53.09,53.59 52.83,53.85 52.83,55.88 v53.34,56.39 | v69.34,60.96 JP4.2
  Bottom 0.254: v53.34,56.39 57.91,60.96 v69.34,60.96
SCK
  Top 0.254: 51.36,48.77 U1.37 51.35,48.77 50.29,48.77 49.53,49.53 42.16,49.53 40.03,47.4 37.34,47.4 35.66,49.07 35.66,61.87 36.88,63.09 36.88,64.77 38.1,65.99 J1.3
SCL  (via drill 0.6)
  Top 0.254: U1.25 v55.63,54.36 | v63.5,15.49 63.5,14.99 62.99,14.48 U$6.12 | U$3.4 49.8,13.48 48.77,12.45 v48.77,11.94
  Bottom 0.254: 58.17,19.56 58.17,53.34 57.15,54.36 v55.63,54.36 | 58.17,19.56 60.2,17.53 62.23,17.53 63.5,16.26 v63.5,15.49 | v48.77,11.94 47.5,11.94 46.23,13.21 46.23,17.78 48.01,19.56 58.17,19.56
SDA  (via drill 0.6)
  Top 0.254: U1.26 55.12,51.5 55.12,53.09 54.61,53.59 54.61,55.88 v55.63,55.88 | v65.28,15.49 65.28,14.99 64.26,13.97 U$6.11 | U$3.6 51.36,11.99 v51.31,11.18
  Bottom 0.254: v55.63,55.88 56.9,55.88 59.44,53.34 59.44,41.66 59.94,41.15 59.94,19.81 60.96,18.8 62.99,18.8 65.28,16.51 v65.28,15.49 69.34,15.49 70.1,14.73 70.1,12.7 69.09,11.68 62.23,11.68 59.69,9.14 52.83,9.14 51.31,10.67 v51.31,11.18
TX0
  Top 0.254: U1.47 51.36,43.74 50.9,43.74 41.91,34.75 41.91,24.84 41.15,24.08 39.32,24.08 38.1,25.3 JP9.RXI
TX1  (via drill 0.6)
  Top 0.254: U1.28 54.13,52.04 53.34,52.83 51.82,52.83 51.31,53.34 v51.31,56.39 | v69.09,63.5 JP4.1
  Bottom 0.254: v51.31,56.39 58.42,63.5 v69.09,63.5
VCC  (via drill 0.6)
  Top 0.254: K1.1 4.72,4.67 4.72,17.48 6.86,19.61 D4.C 7.01,19.76 7.01,67.46 10.97,71.43 U3.9 v10.97,71.58 2.59,79.96 D6.C 2.13,79.65 3.5,81.03 3.5,83.46 K3.1 | K2.1 97.54,82.4 96.47,81.33 84.12,81.33 83.06,82.4 D5.C | JP3.2 42.93,79.76 C10.+ 43.18,76.96 49.02,71.12 50.78,71.12 R3.1
  Bottom 0.254: 97.61,4.6 97.54,4.67 84.12,4.67 83.06,3.61 D7.C | 97.61,4.6 98.6,3.61 K4.1 | 62.79,74.62 62.79,73.56 60.81,71.58 R2.P$2 60.66,71.43 58.06,71.43 56.39,69.75 52.12,69.75 50.9,70.97 R3.1 | 62.79,74.62 62.79,82.09 U$2.1 | 62.79,74.62 70.56,82.4 82.91,82.4 D5.C | 97.61,4.6 97.69,4.67 97.69,82.4 K2.1 | v10.97,71.58 10.97,77.78 12.95,79.76 JP3.2
VCUTOFF
  Top 0.254: R3.2 53.34,79.96 52.12,81.18 U$1.1 51.97,81.33 50.29,83.01 49.53,83.01 JP1.1